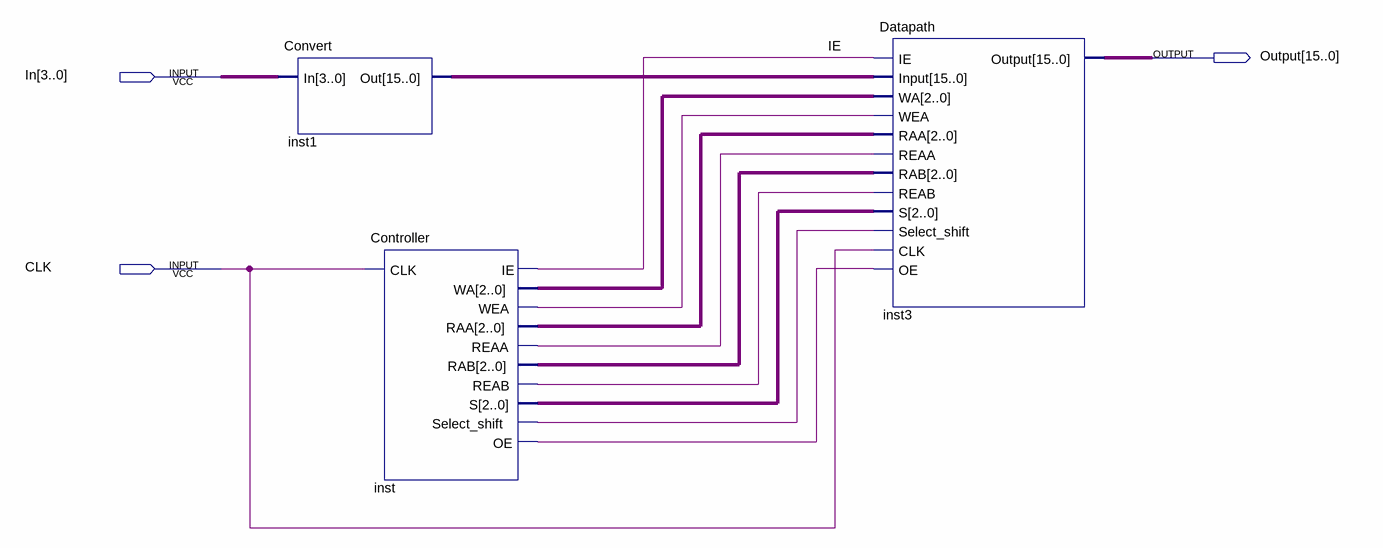
[diagram p0: schematic sheet]
// Quartus schematic Final_CPU_Design.bdf as structural Verilog: 3 symbols, 3 pins
module Final_CPU_Design (
  input  [3:0] In,
  input  CLK,
  output [15:0] Output
);

  wire IE, inst_oe, inst_reaa, inst_reab, inst_select_shift, inst_wea;
  wire [2:0] inst_raa, inst_rab, inst_s, inst_wa;
  wire [15:0] inst1_out;

  Convert inst1 (.In(In), .Out(inst1_out));
  Controller inst (
    .CLK(CLK), .IE(IE), .WA(inst_wa), .WEA(inst_wea), .RAA(inst_raa), .REAA(inst_reaa), .RAB(inst_rab),
    .REAB(inst_reab), .S(inst_s), .Select_shift(inst_select_shift), .OE(inst_oe));
  Datapath inst3 (
    .IE(IE), .Input(inst1_out), .WA(inst_wa), .WEA(inst_wea), .RAA(inst_raa), .REAA(inst_reaa),
    .RAB(inst_rab), .REAB(inst_reab), .S(inst_s), .Select_shift(inst_select_shift), .CLK(CLK), .OE(inst_oe),
    .Output(Output));
endmodule
